# Altium schematic sheet Solenoid driver.SchDoc
size A; SheetNumber: 2; SheetTotal: 2
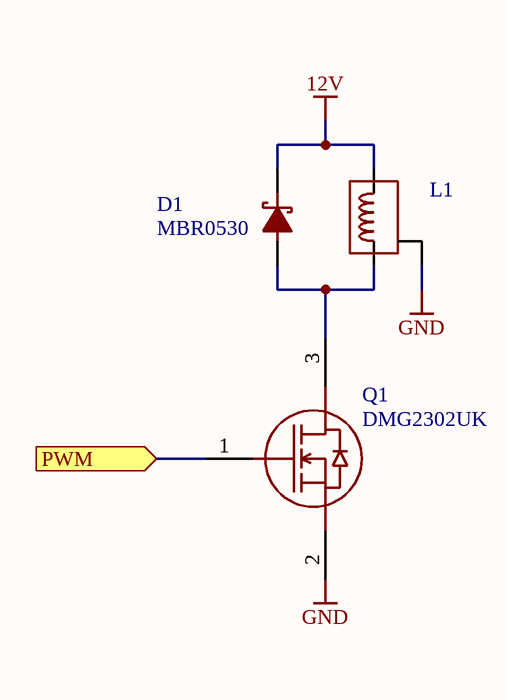
[diagram p0: Solenoid driver.SchDoc]

## Parts
D1  MBR0530  [SOD-123]
L1  (no value)  [P20/15]
Q1  DMG2302UK  [SOT-23]

## Ports
PWM (in)

## Nets
12V: D1.1 L1.2
GND: L1.3 Q1.2(S)
PWM: Q1.1(G) ; port PWM
NetD1_2: D1.2 L1.1 Q1.3(D)

## Library data of the parts
D1 = MBR0530: Schottky Barrier Rectifier, 500mA, 30V; Ref: MBR0530LT1G
L1 = P20/15: Generic 806 Inductor
Q1 = DMG2302UK: N-channel MOSFET; Ref: DMG2302UK